# EAGLE design ext_sensor_board (EAGLE 9.5.0)
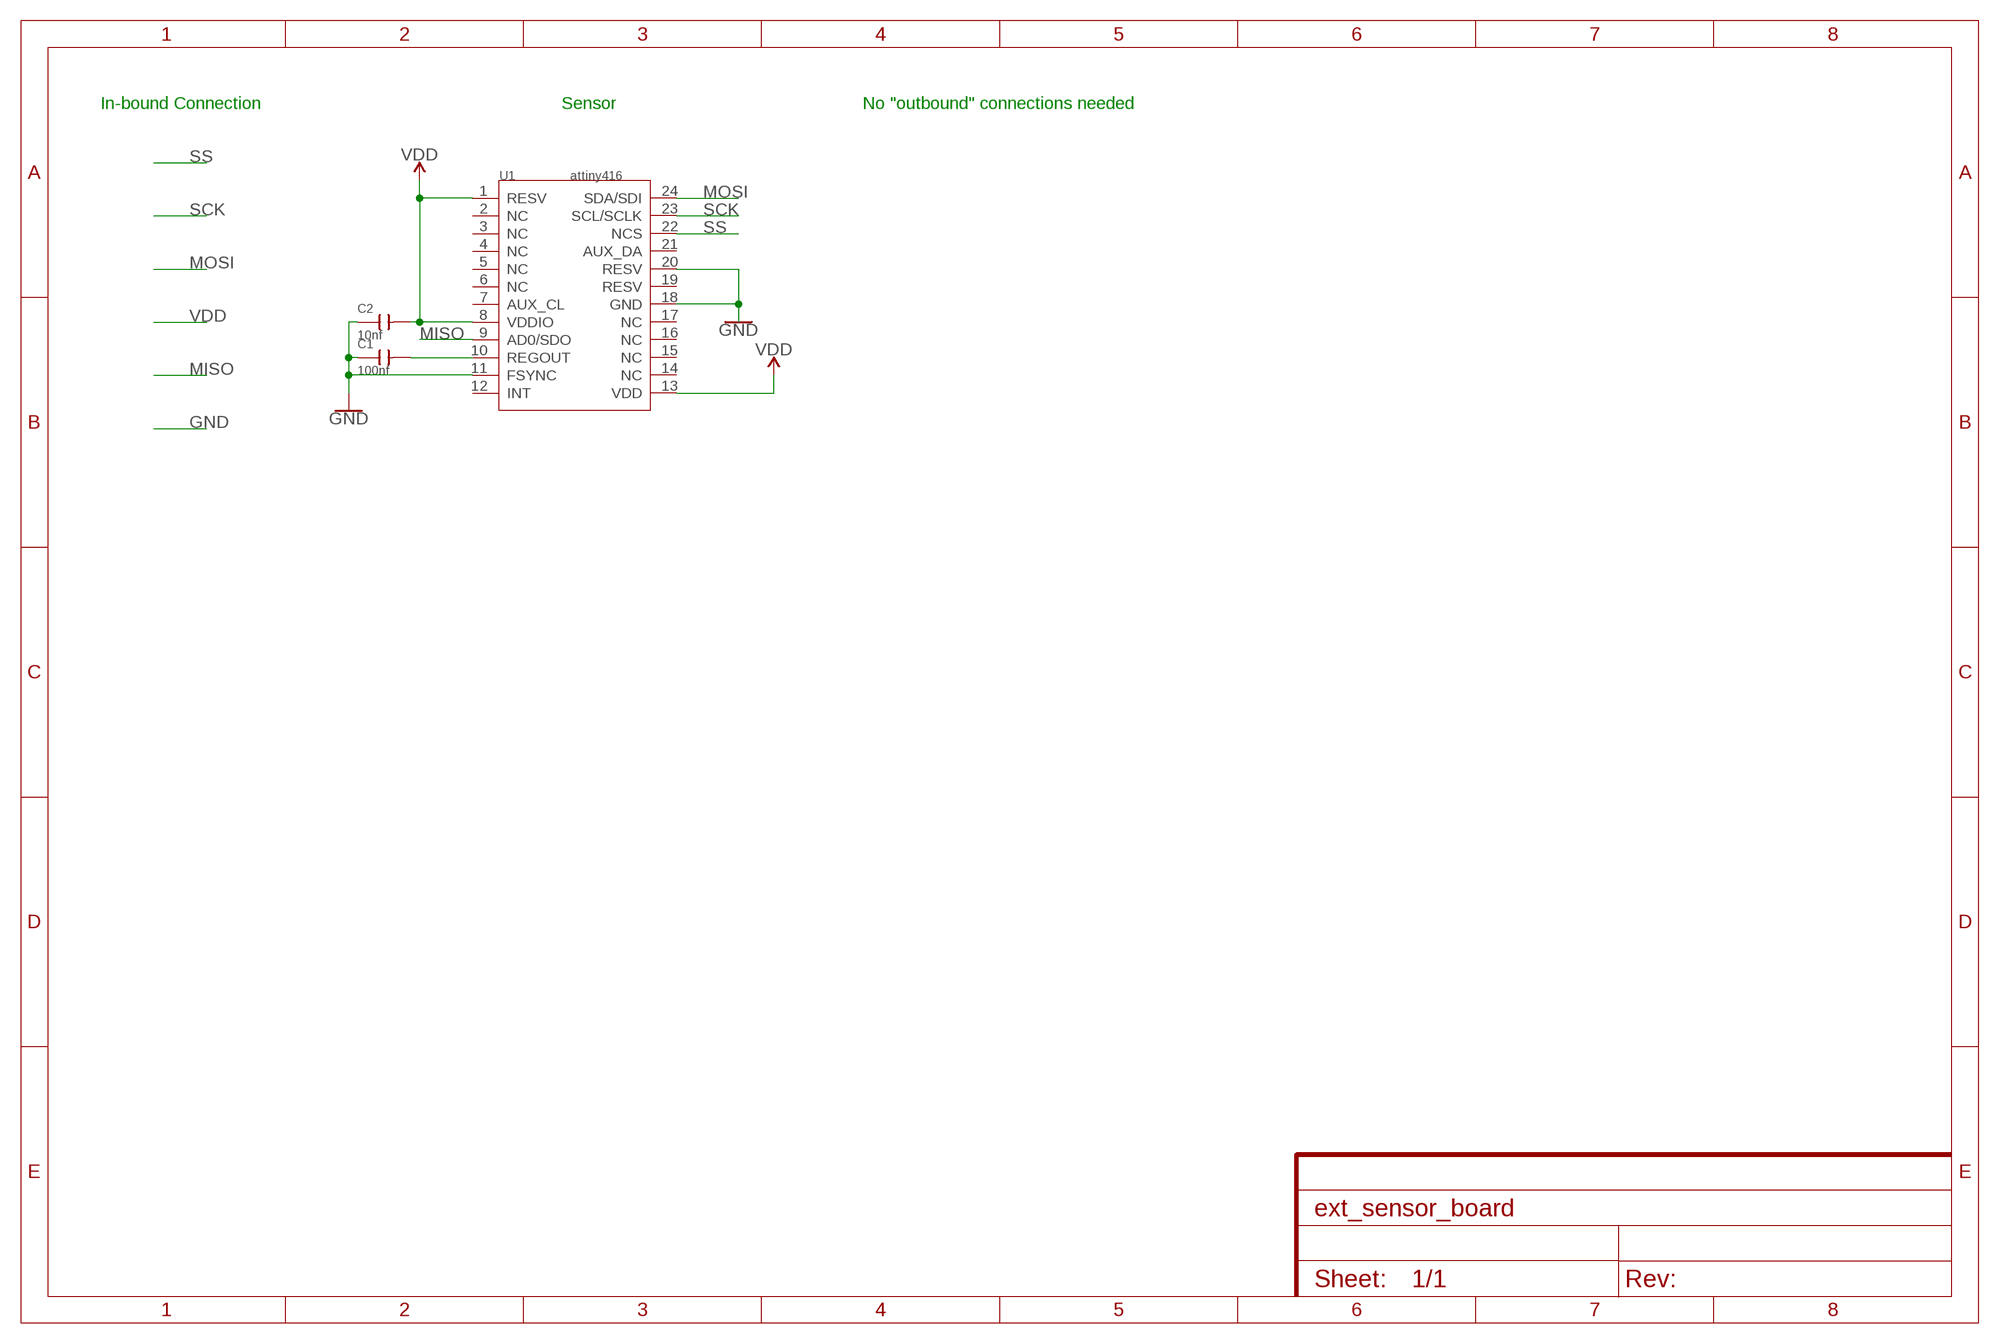
[diagram p0: schematic, sheet 1]

## Parts
C1  100nf  CERAMIC-100NF-25V-10%-X7R(0402)  [C0402]
C2  10nf  CERAMIC-10NF-50V-10%-X7R(0402)  [C0402]
U1  attiny416  MOTION/POSITION-MPU-9250(QFN24G)  [QFN24G-0.4-3X3MM]

## Nets
GND: C1.1 C2.1 U1.11(FSYNC) U1.18(GND) U1.20(RESV)
MISO: U1.9(AD0/SDO)
MOSI: U1.24(SDA/SDI)
N$10: C1.2 U1.10(REGOUT)
SCK: U1.23(SCL/SCLK)
SS: U1.22(NCS)
VDD: C2.2 U1.1(RESV) U1.8(VDDIO) U1.13(VDD)
Unconnected: U1.2(NC) U1.3(NC) U1.4(NC) U1.5(NC) U1.6(NC) U1.7(AUX_CL) U1.12(INT) U1.14(NC) U1.15(NC) U1.16(NC) U1.17(NC) U1.19(RESV) U1.21(AUX_DA)

## Notes on the sheet
- In-bound Connection | Sensor | No "outbound" connections needed

## Library data of the parts
C1 = OPL_Capacitor:CERAMIC-100NF-25V-10%-X7R(0402): 302010024; MPN: CC0402KRX7R8BB104
C2 = OPL_Capacitor:CERAMIC-10NF-50V-10%-X7R(0402): 302010006; MPN: CC0402KRX7R9BB103
U1 = OPL_Sensor-Transducer:MOTION/POSITION-MPU-9250(QFN24G): 314990005

## Board
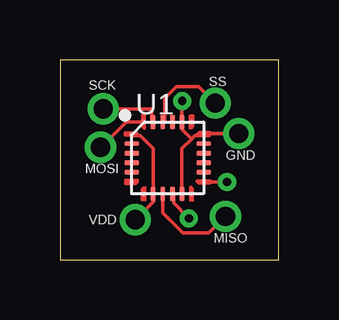
[diagram p1: board, top side]
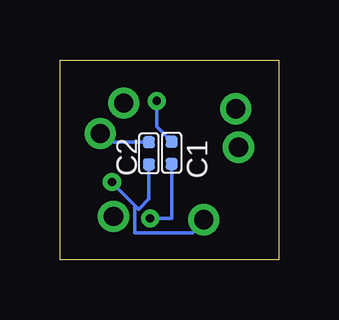
[diagram p2: board, bottom side, seen from below]

Size 9.12 x 8.34 mm. Coordinates in mm from the lower left corner, seen from the top.
Outline: 0,0 9.11,0 9.12,8.34 0.01,8.34 0,0
Copper layers (1*16): Top 0.035mm / dielectric 1.5mm / Bottom 0.035mm
Design rules "default *": minimum track width 6mil, minimum drill 0.3mm, track to track 6mil, track to pad 6mil, pad to pad 6mil, via to via 6mil, smd to smd 6mil, copper to edge 40mil, drill to drill 6mil, minimum pad ring 10mil, minimum via ring 8mil, stop-mask expansion 4mil, vias tented up to drill 0mil, thermal gap 10mil

### Footprints (pad centres in the part's own frame; a part is rotated, then mirrored left to right if it is on the bottom)
C0402 = smd 0.5 x 0.5: 1 0,0.463; 2 0,-0.463
QFN24G-0.4-3X3MM = smd 0.2 x 0.15: 1 -1.5,1; 6 -1.5,-1; 13 1.5,-1; 18 1.5,1 | smd 0.6 x 0.2: 2 -1.5,0.6; 3 -1.5,0.2; 4 -1.5,-0.2; 5 -1.5,-0.6; 14 1.5,-0.6; 15 1.5,-0.2; 16 1.5,0.2; 17 1.5,0.6 | smd 0.15 x 0.2: 7 -1,-1.5; 12 1,-1.5; 19 1,1.5; 24 -1,1.5 | smd 0.2 x 0.6: 8 -0.6,-1.5; 9 -0.2,-1.5; 10 0.2,-1.5; 11 0.6,-1.5; 20 0.6,1.5; 21 0.2,1.5; 22 -0.2,1.5; 23 -0.6,1.5

### Placement (x,y rotation side)
C1  4.47,4.47 0 bottom
C2  5.42,4.44 0 bottom
U1  4.48,4.25 0 top

### Tracks (layer width: path | path; a pad name or v marks a point on that pad's centre or on a via)
GND  (via drill 0.35, 0.8 pad 1.3)
  Top 0.152: 5.48,5.05 5.62,5.18 5.91,5.18 U1.18 6,5.27 v7.45,5.27 | 5.48,5.05 5.08,4.65 U1.11 | 5.48,5.05 5.08,5.45 U1.20 v5.08,6.62 v5.09,6.63
  Bottom 0.152: C1.1 5.09,5.56 v5.09,6.63 | C2.1 7.12,4.91 7.45,5.24 v7.45,5.27
MISO  (via drill 0.8 pad 1.3)
  Top 0.152: U1.9 4.28,1.96 5.12,1.12 6.2,1.12 v6.9,1.82
MOSI  (via drill 0.8 pad 1.3)
  Top 0.152: v1.69,4.7 1.71,4.7 2.77,5.75 U1.24
N$10  (via drill 0.35)
  Top 0.152: v5.37,1.73 5.33,1.77 5.33,1.78 4.73,2.37 4.73,2.7 U1.10
  Bottom 0.152: C1.2 4.47,1.73 v5.37,1.73
SCK  (via drill 0.8 pad 1.3)
  Top 0.152: U1.23 3.81,5.82 3.81,6.3 v1.8,6.3
SS  (via drill 0.8 pad 1.3)
  Top 0.152: U1.22 4.35,5.83 4.35,6.75 4.84,7.24 5.78,7.24 v6.47,6.54
VDD  (via drill 0.35, 0.8 pad 1.3)
  Top 0.152: U1.1 3.05,5.18 3.35,5.18 3.88,4.65 U1.8 3.88,2.44 3.9,2.44 v3.14,1.68 | U1.13 6,3.25 v6.96,3.25
  Bottom 0.152: C2.2 5.42,2.53 5.84,2.11 6,2.27 | 6,2.27 6.96,3.23 v6.96,3.25 | 6,2.27 6,1.12 3.59,1.12 3.14,1.57 v3.14,1.68

### Text on the board
tNames: SCK | SS | MOSI | GND | VDD | MISO